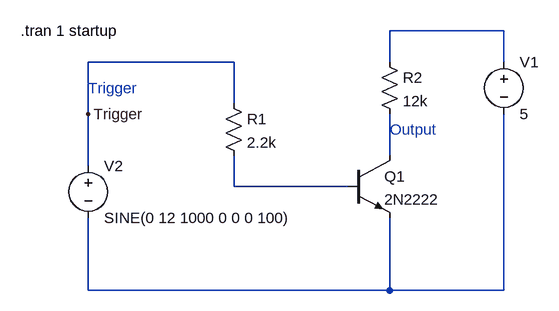
[diagram p0: schematic IR-converter.asc]
IR-converter.asc, the LTspice schematic file:
Version 4
SHEET 1 880 680
WIRE 624 32 448 32
WIRE 208 80 -16 80
WIRE 448 80 448 32
WIRE 624 80 624 32
WIRE 208 144 208 80
WIRE -16 160 -16 80
WIRE 448 224 448 160
WIRE -16 240 -16 160
WIRE 208 272 208 224
WIRE 384 272 208 272
WIRE -16 432 -16 320
WIRE 448 432 448 320
WIRE 448 432 -16 432
WIRE 624 432 624 160
WIRE 624 432 448 432
FLAG -16 160 Trigger
SYMBOL npn 384 224 R0
SYMATTR InstName Q1
SYMATTR Value 2N2222
SYMBOL res 192 128 R0
SYMATTR InstName R1
SYMATTR Value 2.2k
SYMBOL res 432 64 R0
SYMATTR InstName R2
SYMATTR Value 12k
SYMBOL voltage 624 64 R0
SYMATTR InstName V1
SYMATTR Value 5
SYMATTR SpiceLine Rser=0
SYMBOL voltage -16 224 R0
WINDOW 123 0 0 Left 2
WINDOW 39 0 0 Left 2
SYMATTR InstName V2
SYMATTR Value SINE(0 12 1000 0 0 0 100)
TEXT 448 184 Left 2 ;Output
TEXT -16 120 Left 2 ;Trigger
TEXT -120 32 Left 2 !.tran 1 startup

The netlist it stands for:
* IR-converter.asc
Q1 N002 N003 N004 0 2N2222
R1 Trigger N003 2.2k
R2 N001 N002 12k
V1 N001 N004 5 Rser=0
V2 Trigger N004 SINE(0 12 1000 0 0 0 100)
.model NPN NPN
.model PNP PNP
.lib standard.bjt
* Output
* Trigger
.tran 1 startup
.backanno
.end